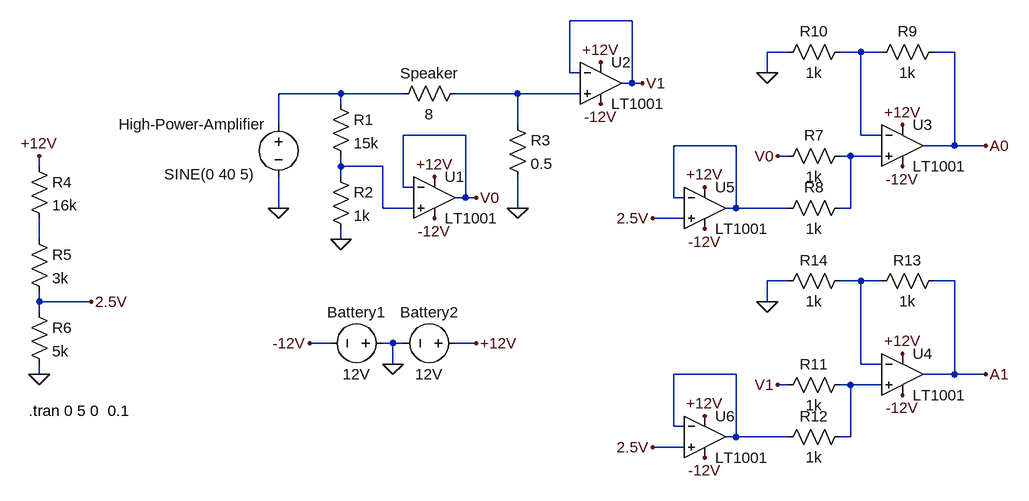
[diagram p0: schematic 2013 Q1.asc]
2013 Q1.asc, the LTspice schematic file:
Version 4
SHEET 1 1416 972
WIRE 816 208 720 208
WIRE 1056 256 1024 256
WIRE 1168 256 1136 256
WIRE 1200 256 1168 256
WIRE 1312 256 1280 256
WIRE 720 288 720 208
WIRE 736 288 720 288
WIRE 1024 288 1024 256
WIRE 816 304 816 208
WIRE 816 304 800 304
WIRE 832 304 816 304
WIRE 368 320 272 320
WIRE 464 320 368 320
WIRE 640 320 544 320
WIRE 736 320 640 320
WIRE 368 336 368 320
WIRE 272 368 272 320
WIRE 640 368 640 320
WIRE 560 384 464 384
WIRE 1168 384 1168 256
WIRE 1200 384 1168 384
WIRE 976 400 880 400
WIRE 1312 400 1312 256
WIRE 1312 400 1264 400
WIRE 1360 400 1312 400
WIRE 1056 416 1040 416
WIRE 1152 416 1136 416
WIRE 1200 416 1152 416
WIRE -96 432 -96 416
WIRE 368 432 368 416
WIRE 432 432 368 432
WIRE 368 448 368 432
WIRE 464 464 464 384
WIRE 480 464 464 464
WIRE 560 480 560 384
WIRE 560 480 544 480
WIRE 576 480 560 480
WIRE 880 480 880 400
WIRE 896 480 880 480
WIRE 272 496 272 448
WIRE 432 496 432 432
WIRE 480 496 432 496
WIRE 640 496 640 448
WIRE 976 496 976 400
WIRE 976 496 960 496
WIRE 1056 496 976 496
WIRE 1152 496 1152 416
WIRE 1152 496 1136 496
WIRE 896 512 848 512
WIRE -96 544 -96 512
WIRE 368 544 368 528
WIRE 1056 608 1024 608
WIRE 1168 608 1136 608
WIRE 1200 608 1168 608
WIRE 1312 608 1280 608
WIRE -96 640 -96 624
WIRE -16 640 -96 640
WIRE 1024 640 1024 608
WIRE -96 656 -96 640
WIRE 352 704 320 704
WIRE 448 704 432 704
WIRE 464 704 448 704
WIRE 576 704 544 704
WIRE 448 736 448 704
WIRE 1168 736 1168 608
WIRE 1200 736 1168 736
WIRE -96 752 -96 736
WIRE 976 752 880 752
WIRE 1312 752 1312 608
WIRE 1312 752 1264 752
WIRE 1360 752 1312 752
WIRE 1056 768 1040 768
WIRE 1152 768 1136 768
WIRE 1200 768 1152 768
WIRE 880 832 880 752
WIRE 896 832 880 832
WIRE 976 848 976 752
WIRE 976 848 960 848
WIRE 1056 848 976 848
WIRE 1152 848 1152 768
WIRE 1152 848 1136 848
WIRE 896 864 848 864
FLAG 368 544 0
FLAG 272 496 0
FLAG 640 496 0
FLAG 576 480 V0
FLAG 832 304 V1
FLAG 576 704 +12V
FLAG 448 736 0
FLAG 320 704 -12V
FLAG -96 416 +12V
FLAG -96 752 0
FLAG 512 512 -12V
FLAG 512 448 +12V
FLAG 1024 288 0
FLAG 1024 640 0
FLAG 1360 400 A0
FLAG 1360 752 A1
FLAG 1232 720 +12V
FLAG 1232 368 +12V
FLAG 1232 784 -12V
FLAG 1232 432 -12V
FLAG 768 336 -12V
FLAG 768 272 +12V
FLAG -16 640 2.5V
FLAG 1040 416 V0
FLAG 1040 768 V1
FLAG 928 528 -12V
FLAG 928 464 +12V
FLAG 928 880 -12V
FLAG 928 816 +12V
FLAG 848 512 2.5V
FLAG 848 864 2.5V
SYMBOL voltage 272 352 R0
WINDOW 0 -246 15 Left 2
WINDOW 3 -176 92 Left 2
SYMATTR InstName High-Power-Amplifier
SYMATTR Value SINE(0 40 5)
SYMBOL res 352 320 R0
SYMATTR InstName R1
SYMATTR Value 15k
SYMBOL res 352 432 R0
SYMATTR InstName R2
SYMATTR Value 1k
SYMBOL res 560 304 R90
WINDOW 0 0 56 VBottom 2
WINDOW 3 32 56 VTop 2
SYMATTR InstName Speaker
SYMATTR Value 8
SYMBOL res 624 352 R0
SYMATTR InstName R3
SYMATTR Value 0.5
SYMBOL voltage 448 704 R90
WINDOW 0 -32 56 VBottom 2
WINDOW 3 32 56 VTop 2
SYMATTR InstName Battery1
SYMATTR Value 12V
SYMBOL voltage 560 704 R90
WINDOW 0 -32 56 VBottom 2
WINDOW 3 32 56 VTop 2
SYMATTR InstName Battery2
SYMATTR Value 12V
SYMBOL res -112 416 R0
SYMATTR InstName R4
SYMATTR Value 16k
SYMBOL res -112 528 R0
SYMATTR InstName R5
SYMATTR Value 3k
SYMBOL res -112 640 R0
SYMATTR InstName R6
SYMATTR Value 5k
SYMBOL Opamps/LT1001 512 416 R0
SYMATTR InstName U1
SYMBOL Opamps/LT1001 1232 336 R0
SYMATTR InstName U3
SYMBOL res 1152 400 R90
WINDOW 0 0 56 VBottom 2
WINDOW 3 32 56 VTop 2
SYMATTR InstName R7
SYMATTR Value 1k
SYMBOL res 1152 480 R90
WINDOW 0 0 56 VBottom 2
WINDOW 3 32 56 VTop 2
SYMATTR InstName R8
SYMATTR Value 1k
SYMBOL res 1296 240 R90
WINDOW 0 0 56 VBottom 2
WINDOW 3 32 56 VTop 2
SYMATTR InstName R9
SYMATTR Value 1k
SYMBOL res 1152 240 R90
WINDOW 0 0 56 VBottom 2
WINDOW 3 32 56 VTop 2
SYMATTR InstName R10
SYMATTR Value 1k
SYMBOL Opamps/LT1001 1232 688 R0
SYMATTR InstName U4
SYMBOL res 1152 752 R90
WINDOW 0 0 56 VBottom 2
WINDOW 3 32 56 VTop 2
SYMATTR InstName R11
SYMATTR Value 1k
SYMBOL res 1152 832 R90
WINDOW 0 0 56 VBottom 2
WINDOW 3 32 56 VTop 2
SYMATTR InstName R12
SYMATTR Value 1k
SYMBOL res 1296 592 R90
WINDOW 0 0 56 VBottom 2
WINDOW 3 32 56 VTop 2
SYMATTR InstName R13
SYMATTR Value 1k
SYMBOL res 1152 592 R90
WINDOW 0 0 56 VBottom 2
WINDOW 3 32 56 VTop 2
SYMATTR InstName R14
SYMATTR Value 1k
SYMBOL Opamps/LT1001 768 240 R0
SYMATTR InstName U2
SYMBOL Opamps/LT1001 928 432 R0
SYMATTR InstName U5
SYMBOL Opamps/LT1001 928 784 R0
SYMATTR InstName U6
TEXT -112 808 Left 2 !.tran 0 5 0  0.1

The netlist it stands for:
* 2013 Q1.asc
V§High-Power-Amplifier N002 0 SINE(0 40 5)
R1 N002 N006 15k
R2 N006 0 1k
R§Speaker N003 N002 8
R3 N003 0 0.5
V§Battery1 0 -12V 12V
V§Battery2 +12V 0 12V
R4 +12V N007 16k
R5 N007 2.5V 3k
R6 2.5V 0 5k
XU1 N006 V0 +12V -12V V0 LT1001  ; pins In+ In- V+ V- OUT
XU3 N005 N001 +12V -12V A0 LT1001  ; pins In+ In- V+ V- OUT
R7 N005 V0 1k
R8 N005 N004 1k
R9 A0 N001 1k
R10 N001 0 1k
XU4 N010 N008 +12V -12V A1 LT1001  ; pins In+ In- V+ V- OUT
R11 N010 V1 1k
R12 N010 N009 1k
R13 A1 N008 1k
R14 N008 0 1k
XU2 N003 V1 +12V -12V V1 LT1001  ; pins In+ In- V+ V- OUT
XU5 2.5V N004 +12V -12V N004 LT1001  ; pins In+ In- V+ V- OUT
XU6 2.5V N009 +12V -12V N009 LT1001  ; pins In+ In- V+ V- OUT
.tran 0 5 0  0.1
.lib LTC.lib
.backanno
.end